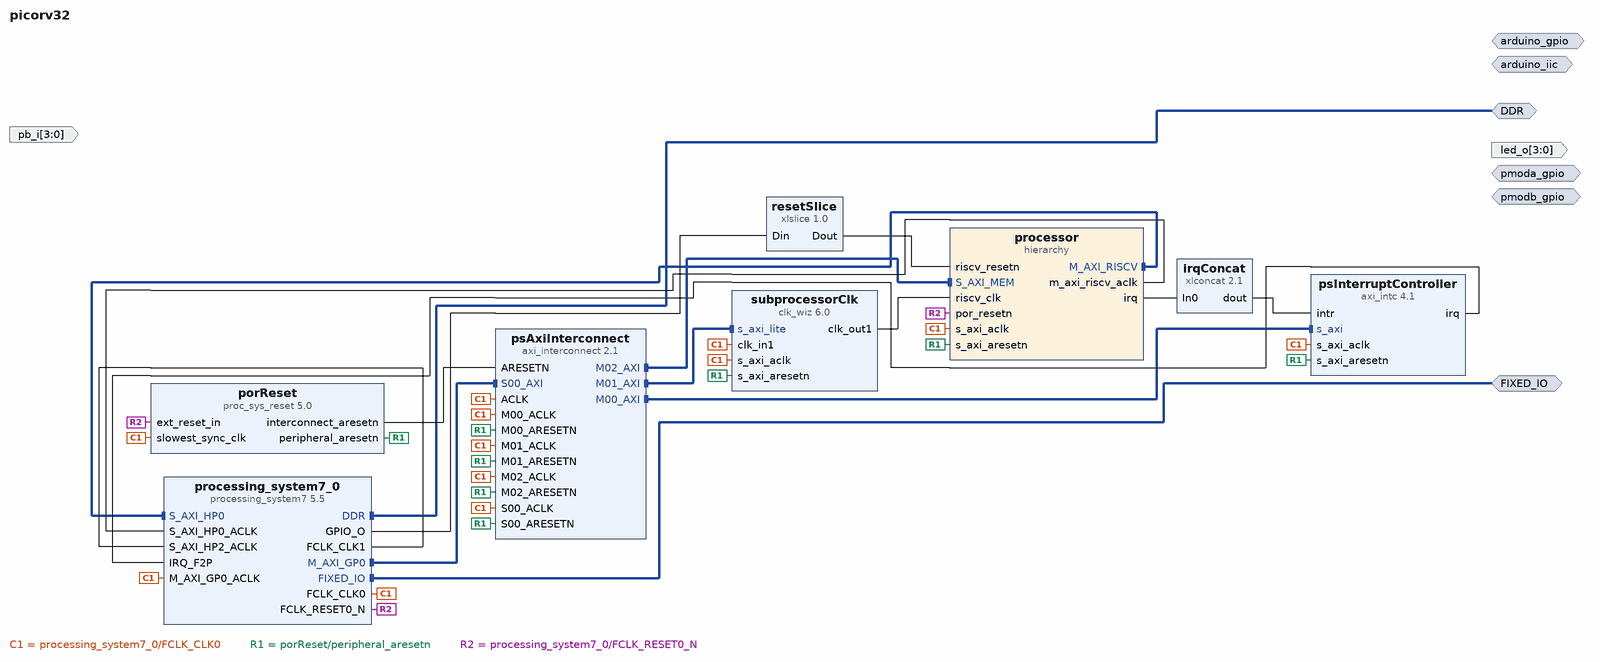
[diagram p0: block diagram of the top level]
# Vivado block design picorv32, xc7z020clg400-1, Vivado 2018.2
create_bd_design picorv32

create_bd_intf_port -mode Master -vlnv xilinx.com:interface:ddrx_rtl:1.0 DDR
create_bd_intf_port -mode Master -vlnv xilinx.com:display_processing_system7:fixedio_rtl:1.0 FIXED_IO
create_bd_intf_port -mode Master -vlnv xilinx.com:interface:gpio_rtl:1.0 arduino_gpio
create_bd_intf_port -mode Master -vlnv xilinx.com:interface:iic_rtl:1.0 arduino_iic
create_bd_intf_port -mode Master -vlnv xilinx.com:interface:gpio_rtl:1.0 pmoda_gpio
create_bd_intf_port -mode Master -vlnv xilinx.com:interface:gpio_rtl:1.0 pmodb_gpio
create_bd_port -dir O -from 3 -to 0 led_o
create_bd_port -dir I -from 3 -to 0 pb_i

create_bd_cell -type ip -vlnv xilinx.com:ip:xlconcat:2.1 irqConcat
set_property -dict {CONFIG.NUM_PORTS 1} [get_bd_cells irqConcat]
create_bd_cell -type hier processor
create_bd_cell -type ip -vlnv xilinx.com:ip:proc_sys_reset:5.0 porReset
set_property -dict {CONFIG.C_AUX_RST_WIDTH 1 CONFIG.C_EXT_RST_WIDTH 1} [get_bd_cells porReset]
create_bd_cell -type ip -vlnv xilinx.com:ip:processing_system7:5.5 processing_system7_0
set_property -dict [list \
  CONFIG.PCW_FCLK_CLK1_BUF TRUE \
  CONFIG.PCW_UIPARAM_DDR_FREQ_MHZ 525 \
  CONFIG.PCW_CRYSTAL_PERIPHERAL_FREQMHZ 50 \
  CONFIG.PCW_APU_PERIPHERAL_FREQMHZ 650 \
  CONFIG.PCW_SDIO_PERIPHERAL_FREQMHZ 50 \
  CONFIG.PCW_UART_PERIPHERAL_FREQMHZ 100 \
  CONFIG.PCW_FPGA0_PERIPHERAL_FREQMHZ 50 \
  CONFIG.PCW_FPGA1_PERIPHERAL_FREQMHZ 50 \
  CONFIG.PCW_FPGA2_PERIPHERAL_FREQMHZ 100 \
  CONFIG.PCW_FPGA3_PERIPHERAL_FREQMHZ 160 \
  CONFIG.PCW_USE_S_AXI_HP0 1 \
  CONFIG.PCW_USE_S_AXI_HP2 1 \
  CONFIG.PCW_USE_FABRIC_INTERRUPT 1 \
  CONFIG.PCW_GPIO_EMIO_GPIO_WIDTH 7 \
  CONFIG.PCW_EN_CLK1_PORT 1 \
  CONFIG.PCW_IRQ_F2P_INTR 1 \
  CONFIG.PCW_PERIPHERAL_BOARD_PRESET None \
  CONFIG.PCW_PRESET_BANK1_VOLTAGE {LVCMOS 1.8V} \
  CONFIG.PCW_UIPARAM_DDR_BUS_WIDTH {16 Bit} \
  CONFIG.PCW_UIPARAM_DDR_PARTNO Custom \
  CONFIG.PCW_QSPI_PERIPHERAL_ENABLE 1 \
  CONFIG.PCW_QSPI_QSPI_IO {MIO 1 .. 6} \
  CONFIG.PCW_QSPI_GRP_SINGLE_SS_ENABLE 1 \
  CONFIG.PCW_QSPI_GRP_SINGLE_SS_IO {MIO 1 .. 6} \
  CONFIG.PCW_SINGLE_QSPI_DATA_MODE x4 \
  CONFIG.PCW_QSPI_GRP_FBCLK_ENABLE 1 \
  CONFIG.PCW_QSPI_GRP_FBCLK_IO {MIO 8} \
  CONFIG.PCW_ENET0_PERIPHERAL_ENABLE 1 \
  CONFIG.PCW_ENET0_ENET0_IO {MIO 16 .. 27} \
  CONFIG.PCW_ENET0_GRP_MDIO_ENABLE 1 \
  CONFIG.PCW_ENET0_GRP_MDIO_IO {MIO 52 .. 53} \
  CONFIG.PCW_SD0_PERIPHERAL_ENABLE 1 \
  CONFIG.PCW_SD0_SD0_IO {MIO 40 .. 45} \
  CONFIG.PCW_SD0_GRP_CD_ENABLE 1 \
  CONFIG.PCW_SD0_GRP_CD_IO {MIO 47} \
  CONFIG.PCW_SD0_GRP_WP_ENABLE 0 \
  CONFIG.PCW_UART0_PERIPHERAL_ENABLE 1 \
  CONFIG.PCW_UART0_UART0_IO {MIO 14 .. 15} \
  CONFIG.PCW_UART1_PERIPHERAL_ENABLE 0 \
  CONFIG.PCW_USB0_PERIPHERAL_ENABLE 1 \
  CONFIG.PCW_USB0_USB0_IO {MIO 28 .. 39} \
  CONFIG.PCW_GPIO_MIO_GPIO_ENABLE 0 \
  CONFIG.PCW_GPIO_EMIO_GPIO_ENABLE 1 \
  CONFIG.PCW_GPIO_EMIO_GPIO_IO 7 \
  CONFIG.PCW_FPGA_FCLK1_ENABLE 1 \
] [get_bd_cells processing_system7_0]
# 474 more settings of processing_system7_0 are not shown: defaults, MIO pin electricals, DDR timing, and values the tool derives
create_bd_cell -type ip -vlnv xilinx.com:ip:axi_interconnect:2.1 psAxiInterconnect
set_property -dict {CONFIG.NUM_MI 3} [get_bd_cells psAxiInterconnect]
create_bd_cell -type ip -vlnv xilinx.com:ip:axi_intc:4.1 psInterruptController
create_bd_cell -type ip -vlnv xilinx.com:ip:xlslice:1.0 resetSlice
set_property -dict {CONFIG.DIN_TO 0 CONFIG.DIN_FROM 0 CONFIG.DIN_WIDTH 7} [get_bd_cells resetSlice]
create_bd_cell -type ip -vlnv xilinx.com:ip:clk_wiz:6.0 subprocessorClk
set_property -dict [list \
  CONFIG.USE_PHASE_ALIGNMENT false \
  CONFIG.USE_DYN_RECONFIG true \
  CONFIG.SECONDARY_SOURCE Single_ended_clock_capable_pin \
  CONFIG.CLKIN1_JITTER_PS 200.0 \
  CONFIG.CLKOUT1_REQUESTED_OUT_FREQ 50 \
  CONFIG.CLKOUT1_DRIVES BUFG \
  CONFIG.CLKOUT2_DRIVES BUFG \
  CONFIG.CLKOUT3_DRIVES BUFG \
  CONFIG.CLKOUT4_DRIVES BUFG \
  CONFIG.CLKOUT5_DRIVES BUFG \
  CONFIG.CLKOUT6_DRIVES BUFG \
  CONFIG.CLKOUT7_DRIVES BUFG \
  CONFIG.USE_LOCKED true \
  CONFIG.RESET_PORT reset \
  CONFIG.MMCM_DIVCLK_DIVIDE 1 \
  CONFIG.MMCM_CLKFBOUT_MULT_F 20.000 \
  CONFIG.MMCM_CLKIN1_PERIOD 20.000 \
  CONFIG.MMCM_CLKIN2_PERIOD 10.0 \
  CONFIG.MMCM_CLKOUT0_DIVIDE_F 20.000 \
  CONFIG.RESET_TYPE ACTIVE_HIGH \
  CONFIG.CLKOUT1_JITTER 192.113 \
  CONFIG.CLKOUT1_PHASE_ERROR 164.985 \
] [get_bd_cells subprocessorClk]

# ---- hierarchy /processor ----
current_bd_instance /processor
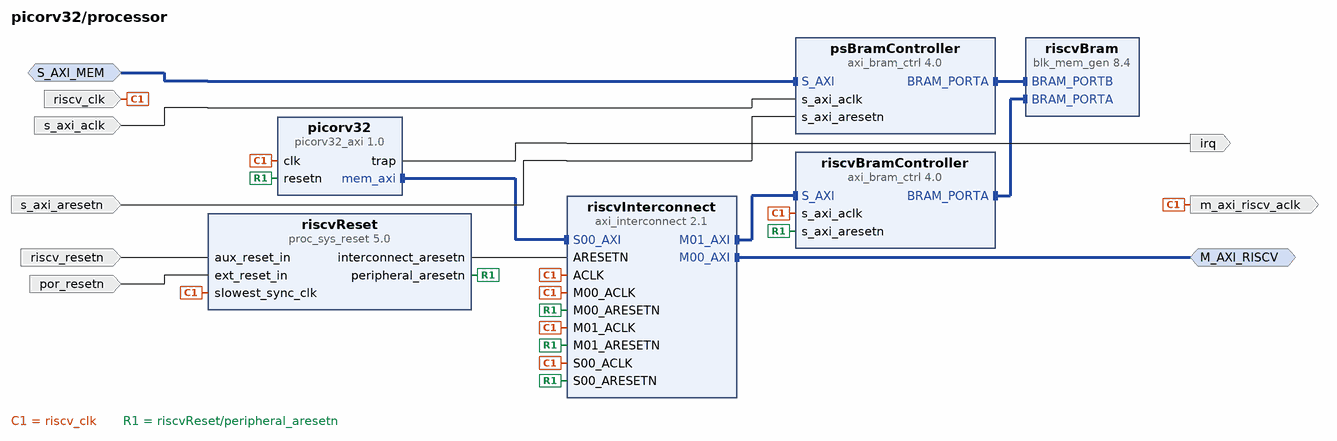
[diagram p1: block diagram inside /processor]
create_bd_intf_pin -mode Master -vlnv xilinx.com:interface:aximm_rtl:1.0 M_AXI_RISCV
create_bd_intf_pin -mode Slave -vlnv xilinx.com:interface:aximm_rtl:1.0 S_AXI_MEM
create_bd_pin -dir O irq
create_bd_pin -dir O m_axi_riscv_aclk
create_bd_pin -dir I -type rst por_resetn
create_bd_pin -dir I -type clk riscv_clk
create_bd_pin -dir I -type rst riscv_resetn
create_bd_pin -dir I -type clk s_axi_aclk
create_bd_pin -dir I -type rst s_axi_aresetn

create_bd_cell -type ip -vlnv cliffordwolf:ip:picorv32_axi:1.0 picorv32
set_property -dict [list \
  CONFIG.ENABLE_COUNTERS true \
  CONFIG.ENABLE_COUNTERS64 false \
  CONFIG.ENABLE_REGS_16_31 true \
  CONFIG.ENABLE_REGS_DUALPORT true \
  CONFIG.CATCH_MISALIGN false \
  CONFIG.CATCH_ILLINSN false \
  CONFIG.ENABLE_FAST_MUL true \
  CONFIG.ENABLE_DIV true \
  CONFIG.ENABLE_IRQ_QREGS false \
  CONFIG.ENABLE_IRQ_TIMER false \
  CONFIG.STACKADDR 0x00000000 \
] [get_bd_cells picorv32]
create_bd_cell -type ip -vlnv xilinx.com:ip:axi_bram_ctrl:4.0 psBramController
set_property -dict {CONFIG.PROTOCOL AXI4 CONFIG.SINGLE_PORT_BRAM 1} [get_bd_cells psBramController]
create_bd_cell -type ip -vlnv xilinx.com:ip:blk_mem_gen:8.4 riscvBram
set_property -dict [list \
  CONFIG.Memory_Type True_Dual_Port_RAM \
  CONFIG.Enable_32bit_Address true \
  CONFIG.Assume_Synchronous_Clk false \
  CONFIG.Enable_B Use_ENB_Pin \
  CONFIG.Register_PortA_Output_of_Memory_Primitives false \
  CONFIG.Register_PortB_Output_of_Memory_Primitives false \
  CONFIG.Use_RSTA_Pin true \
  CONFIG.Use_RSTB_Pin true \
  CONFIG.Port_B_Clock 100 \
  CONFIG.Port_B_Write_Rate 50 \
  CONFIG.Port_B_Enable_Rate 100 \
  CONFIG.use_bram_block BRAM_Controller \
  CONFIG.EN_SAFETY_CKT false \
] [get_bd_cells riscvBram]
create_bd_cell -type ip -vlnv xilinx.com:ip:axi_bram_ctrl:4.0 riscvBramController
set_property -dict {CONFIG.PROTOCOL AXI4LITE CONFIG.SINGLE_PORT_BRAM 1} [get_bd_cells riscvBramController]
create_bd_cell -type ip -vlnv xilinx.com:ip:axi_interconnect:2.1 riscvInterconnect
create_bd_cell -type ip -vlnv xilinx.com:ip:proc_sys_reset:5.0 riscvReset
set_property -dict {CONFIG.C_AUX_RST_WIDTH 1 CONFIG.C_EXT_RST_WIDTH 1} [get_bd_cells riscvReset]

# ---- connections ----

current_bd_instance /processor
connect_bd_intf_net -intf_net axi_interconnect_0_M01_AXI [get_bd_intf_pins riscvBramController/S_AXI] [get_bd_intf_pins riscvInterconnect/M01_AXI]
connect_bd_intf_net [get_bd_intf_pins picorv32/mem_axi] [get_bd_intf_pins riscvInterconnect/S00_AXI]
connect_bd_intf_net [get_bd_intf_pins psBramController/BRAM_PORTA] [get_bd_intf_pins riscvBram/BRAM_PORTB]
connect_bd_intf_net [get_bd_intf_pins riscvBram/BRAM_PORTA] [get_bd_intf_pins riscvBramController/BRAM_PORTA]
connect_bd_intf_net [get_bd_intf_pins M_AXI_RISCV] [get_bd_intf_pins riscvInterconnect/M00_AXI]
connect_bd_intf_net [get_bd_intf_pins S_AXI_MEM] [get_bd_intf_pins psBramController/S_AXI]
connect_bd_net -net ARESETN_1 [get_bd_pins riscvReset/interconnect_aresetn] [get_bd_pins riscvInterconnect/ARESETN]
connect_bd_net -net aux_reset_in_1 [get_bd_pins riscv_resetn] [get_bd_pins riscvReset/aux_reset_in]
connect_bd_net -net clk_in1_1 [get_bd_pins s_axi_aclk] [get_bd_pins psBramController/s_axi_aclk]
connect_bd_net -net ext_reset_in_1 [get_bd_pins por_resetn] [get_bd_pins riscvReset/ext_reset_in]
connect_bd_net [get_bd_pins picorv32/trap] [get_bd_pins irq]
connect_bd_net -net subprocessorClk [get_bd_pins riscv_clk] \
  [get_bd_pins m_axi_riscv_aclk] [get_bd_pins picorv32/clk] [get_bd_pins riscvBramController/s_axi_aclk] \
  [get_bd_pins riscvInterconnect/ACLK] [get_bd_pins riscvInterconnect/M00_ACLK] [get_bd_pins riscvInterconnect/M01_ACLK] \
  [get_bd_pins riscvInterconnect/S00_ACLK] [get_bd_pins riscvReset/slowest_sync_clk]
connect_bd_net [get_bd_pins riscvReset/peripheral_aresetn] \
  [get_bd_pins picorv32/resetn] [get_bd_pins riscvBramController/s_axi_aresetn] [get_bd_pins riscvInterconnect/M00_ARESETN] \
  [get_bd_pins riscvInterconnect/M01_ARESETN] [get_bd_pins riscvInterconnect/S00_ARESETN]
connect_bd_net [get_bd_pins s_axi_aresetn] [get_bd_pins psBramController/s_axi_aresetn]

current_bd_instance /
connect_bd_intf_net [get_bd_intf_pins processor/M_AXI_RISCV] [get_bd_intf_pins processing_system7_0/S_AXI_HP0]
connect_bd_intf_net [get_bd_intf_pins processor/S_AXI_MEM] [get_bd_intf_pins psAxiInterconnect/M02_AXI]
connect_bd_intf_net -intf_net S_AXI_PSX [get_bd_intf_pins processing_system7_0/M_AXI_GP0] [get_bd_intf_pins psAxiInterconnect/S00_AXI]
connect_bd_intf_net [get_bd_intf_pins psAxiInterconnect/M00_AXI] [get_bd_intf_pins psInterruptController/s_axi]
connect_bd_intf_net [get_bd_intf_pins psAxiInterconnect/M01_AXI] [get_bd_intf_pins subprocessorClk/s_axi_lite]
connect_bd_intf_net [get_bd_intf_ports DDR] [get_bd_intf_pins processing_system7_0/DDR]
connect_bd_intf_net [get_bd_intf_ports FIXED_IO] [get_bd_intf_pins processing_system7_0/FIXED_IO]
connect_bd_net -net FCLK_CLK0 [get_bd_pins processing_system7_0/FCLK_CLK0] \
  [get_bd_pins processor/s_axi_aclk] [get_bd_pins porReset/slowest_sync_clk] \
  [get_bd_pins processing_system7_0/M_AXI_GP0_ACLK] [get_bd_pins psAxiInterconnect/ACLK] \
  [get_bd_pins psAxiInterconnect/M00_ACLK] [get_bd_pins psAxiInterconnect/M01_ACLK] [get_bd_pins psAxiInterconnect/M02_ACLK] \
  [get_bd_pins psAxiInterconnect/S00_ACLK] [get_bd_pins psInterruptController/s_axi_aclk] \
  [get_bd_pins subprocessorClk/clk_in1] [get_bd_pins subprocessorClk/s_axi_aclk]
connect_bd_net -net FCLK_CLK1 [get_bd_pins processing_system7_0/FCLK_CLK1] [get_bd_pins processing_system7_0/S_AXI_HP2_ACLK]
connect_bd_net -net S00_ARESETN_1 [get_bd_pins porReset/peripheral_aresetn] \
  [get_bd_pins processor/s_axi_aresetn] [get_bd_pins psAxiInterconnect/M00_ARESETN] \
  [get_bd_pins psAxiInterconnect/M01_ARESETN] [get_bd_pins psAxiInterconnect/M02_ARESETN] \
  [get_bd_pins psAxiInterconnect/S00_ARESETN] [get_bd_pins psInterruptController/s_axi_aresetn] \
  [get_bd_pins subprocessorClk/s_axi_aresetn]
connect_bd_net -net irq [get_bd_pins processor/irq] [get_bd_pins irqConcat/In0]
connect_bd_net -net m_axi_riscv_aclk [get_bd_pins processor/m_axi_riscv_aclk] [get_bd_pins processing_system7_0/S_AXI_HP0_ACLK]
connect_bd_net [get_bd_pins porReset/interconnect_aresetn] [get_bd_pins psAxiInterconnect/ARESETN]
connect_bd_net -net por_resetn [get_bd_pins processing_system7_0/FCLK_RESET0_N] [get_bd_pins processor/por_resetn] [get_bd_pins porReset/ext_reset_in]
connect_bd_net [get_bd_pins processing_system7_0/GPIO_O] [get_bd_pins resetSlice/Din]
connect_bd_net -net psirq [get_bd_pins psInterruptController/irq] [get_bd_pins processing_system7_0/IRQ_F2P]
connect_bd_net -net subprocessorClk [get_bd_pins subprocessorClk/clk_out1] [get_bd_pins processor/riscv_clk]
connect_bd_net -net riscv_resetn [get_bd_pins resetSlice/Dout] [get_bd_pins processor/riscv_resetn]
connect_bd_net -net xlconcat_0_dout [get_bd_pins irqConcat/dout] [get_bd_pins psInterruptController/intr]

# ---- address map ----
assign_bd_address -offset 0x40001000 -range 4K -target_address_space [get_bd_addr_spaces processing_system7_0/Data] [get_bd_addr_segs subprocessorClk/s_axi_lite/Reg]
assign_bd_address -offset 0x40010000 -range 64K -target_address_space [get_bd_addr_spaces processing_system7_0/Data] [get_bd_addr_segs processor/psBramController/S_AXI/Mem0]
assign_bd_address -offset 0x40020000 -range 64K -target_address_space [get_bd_addr_spaces processing_system7_0/Data] [get_bd_addr_segs psInterruptController/S_AXI/Reg]
assign_bd_address -offset 0x00000000 -range 64K -target_address_space [get_bd_addr_spaces processor/picorv32/mem_axi] [get_bd_addr_segs processor/riscvBramController/S_AXI/Mem0]
assign_bd_address -offset 0x10000000 -range 256M -target_address_space [get_bd_addr_spaces processor/picorv32/mem_axi] [get_bd_addr_segs processing_system7_0/S_AXI_HP0/HP0_DDR_LOWOCM]

validate_bd_design
save_bd_design
